# EAGLE design sensors-v2 (EAGLE 9.6.2)
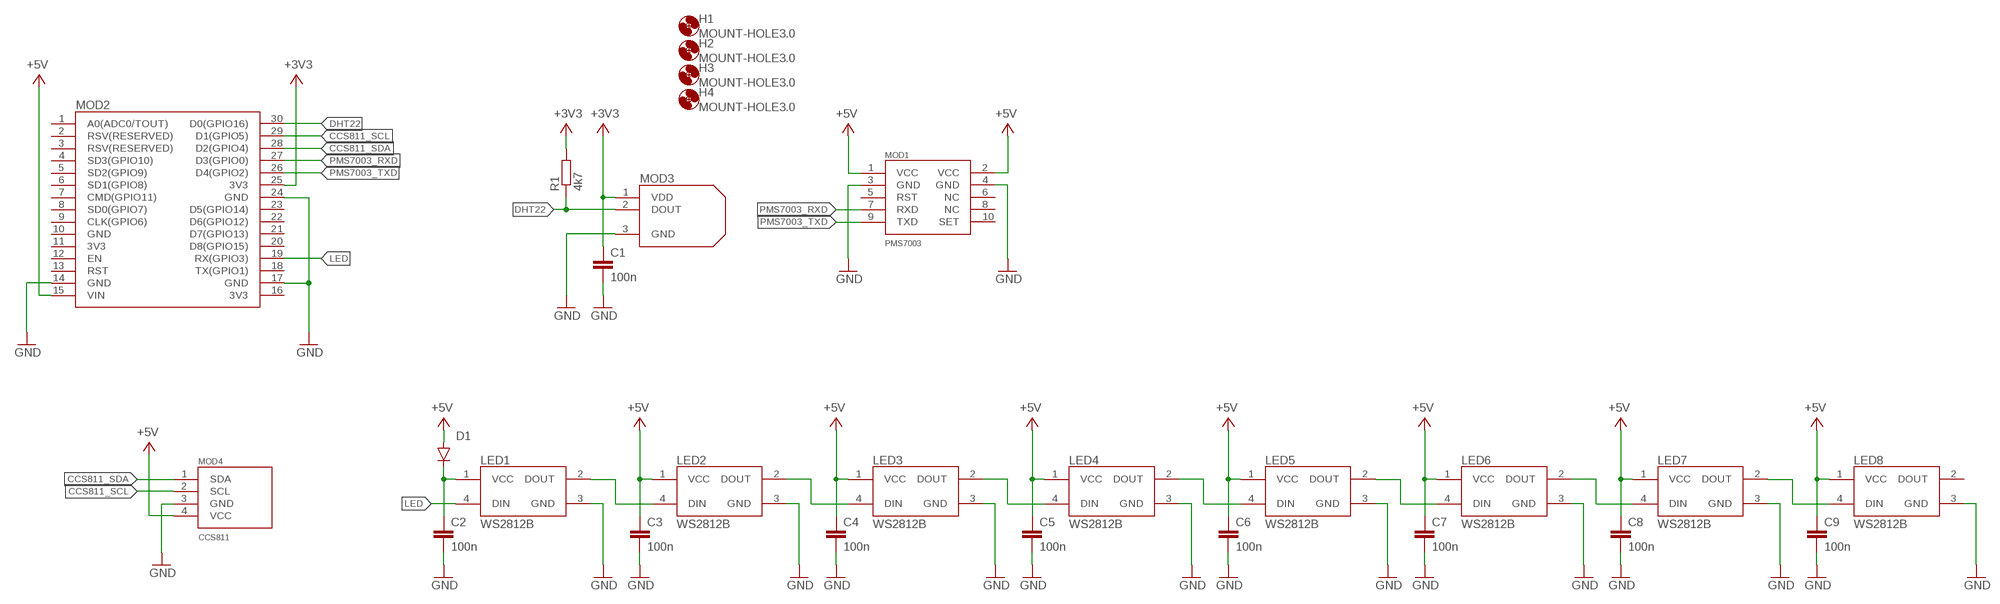
[diagram p0: schematic, sheet 1]

## Parts
C1  100n  C-EUC0603  [C0603]
C2  100n  C-EUC0603  [C0603]
C3  100n  C-EUC0603  [C0603]
C4  100n  C-EUC0603  [C0603]
C5  100n  C-EUC0603  [C0603]
C6  100n  C-EUC0603  [C0603]
C7  100n  C-EUC0603  [C0603]
C8  100n  C-EUC0603  [C0603]
C9  100n  C-EUC0603  [C0603]
D1  DIODE-MINIMELF  [MINIMELF]
H1  MOUNT-HOLE3.0  [3,0]
H2  MOUNT-HOLE3.0  [3,0]
H3  MOUNT-HOLE3.0  [3,0]
H4  MOUNT-HOLE3.0  [3,0]
LED1  WS2812B  [WS2812B]
LED2  WS2812B  [WS2812B]
LED3  WS2812B  [WS2812B]
LED4  WS2812B  [WS2812B]
LED5  WS2812B  [WS2812B]
LED6  WS2812B  [WS2812B]
LED7  WS2812B  [WS2812B]
LED8  WS2812B  [WS2812B]
MOD1  PMS7003  [PMS7003]
MOD2  NODEMCU  NODEMCUWITHOUT-HOLES  [NODEMCU-WITHOUT-HOLES]
MOD3  DHT22  DHT22-3PIN  [DHT22_STRAIGHT-3PIN]
MOD4  CCS811  CCS811_ANGLE  [HDRRAR4W64P254_1X4_1016X736X254B]
R1  4k7  R-EU_M0805  [M0805]

## Nets
+3V3: C1.1 MOD2.25(3V3) MOD3.1(VDD) R1.2
+5V: C3.1 C4.1 C5.1 C6.1 C7.1 C8.1 C9.1 D1.A LED2.1(VCC) LED3.1(VCC) LED4.1(VCC) LED5.1(VCC) LED6.1(VCC) LED7.1(VCC) LED8.1(VCC) MOD1.1(VCC) MOD1.2(VCC) MOD2.15(VIN) MOD4.4(VCC)
CCS811_SCL: MOD2.29(D1(GPIO5)) MOD4.2(SCL)
CCS811_SDA: MOD2.28(D2(GPIO4)) MOD4.1(SDA)
DHT22: MOD2.30(D0(GPIO16)) MOD3.2(DOUT) R1.1
GND: C1.2 C2.2 C3.2 C4.2 C5.2 C6.2 C7.2 C8.2 C9.2 LED1.3(GND) LED2.3(GND) LED3.3(GND) LED4.3(GND) LED5.3(GND) LED6.3(GND) LED7.3(GND) LED8.3(GND) MOD1.3(GND) MOD1.4(GND) MOD2.14(GND) MOD2.17(GND) MOD2.24(GND) MOD3.3(GND) MOD4.3(GND)
LED: LED1.4(DIN) MOD2.19(RX(GPIO3))
N$1: C2.1 D1.C LED1.1(VCC)
N$2: LED2.2(DOUT) LED3.4(DIN)
N$3: LED3.2(DOUT) LED4.4(DIN)
N$4: LED1.2(DOUT) LED2.4(DIN)
N$5: LED4.2(DOUT) LED5.4(DIN)
N$6: LED5.2(DOUT) LED6.4(DIN)
N$7: LED6.2(DOUT) LED7.4(DIN)
N$8: LED7.2(DOUT) LED8.4(DIN)
PMS7003_RXD: MOD1.7(RXD) MOD2.27(D3(GPIO0))
PMS7003_TXD: MOD1.9(TXD) MOD2.26(D4(GPIO2))
Unconnected: LED8.2(DOUT) MOD1.5(RST) MOD1.6(NC) MOD1.8(NC) MOD1.10(SET) MOD2.1(A0(ADC0/TOUT)) MOD2.2(RSV(RESERVED)) MOD2.3(RSV(RESERVED)) MOD2.4(SD3(GPIO10)) MOD2.5(SD2(GPIO9)) MOD2.6(SD1(GPIO8)) MOD2.7(CMD(GPIO11)) MOD2.8(SD0(GPIO7)) MOD2.9(CLK(GPIO6)) MOD2.10(GND) MOD2.11(3V3) MOD2.12(EN) MOD2.13(RST) MOD2.16(3V3) MOD2.18(TX(GPIO1)) MOD2.20(D8(GPIO15)) MOD2.21(D7(GPIO13)) MOD2.22(D6(GPIO12)) MOD2.23(D5(GPIO14))

## Library data of the parts
C1-C9 = rcl:C-EU: CAPACITOR, European symbol; SPICEPREFIX: C
D1 = diode:DIODE-: DIODE
H1-H4 = _Leon-Connectors:MOUNT-HOLE: MOUNTING HOLE with drill center marker
LED1-LED8 = _Leon-IC:WS2812B; PACKAGE: 5050
MOD1 = _Leon-Modules:PMS7003
MOD2 = _Leon-Modules:NODEMCU
MOD3 = _Leon-Modules:DHT22-3PIN
MOD4 = _Leon-Modules:CCS811_ANGLE
R1 = rcl:R-EU_: RESISTOR, European symbol; SPICEPREFIX: R

## Board
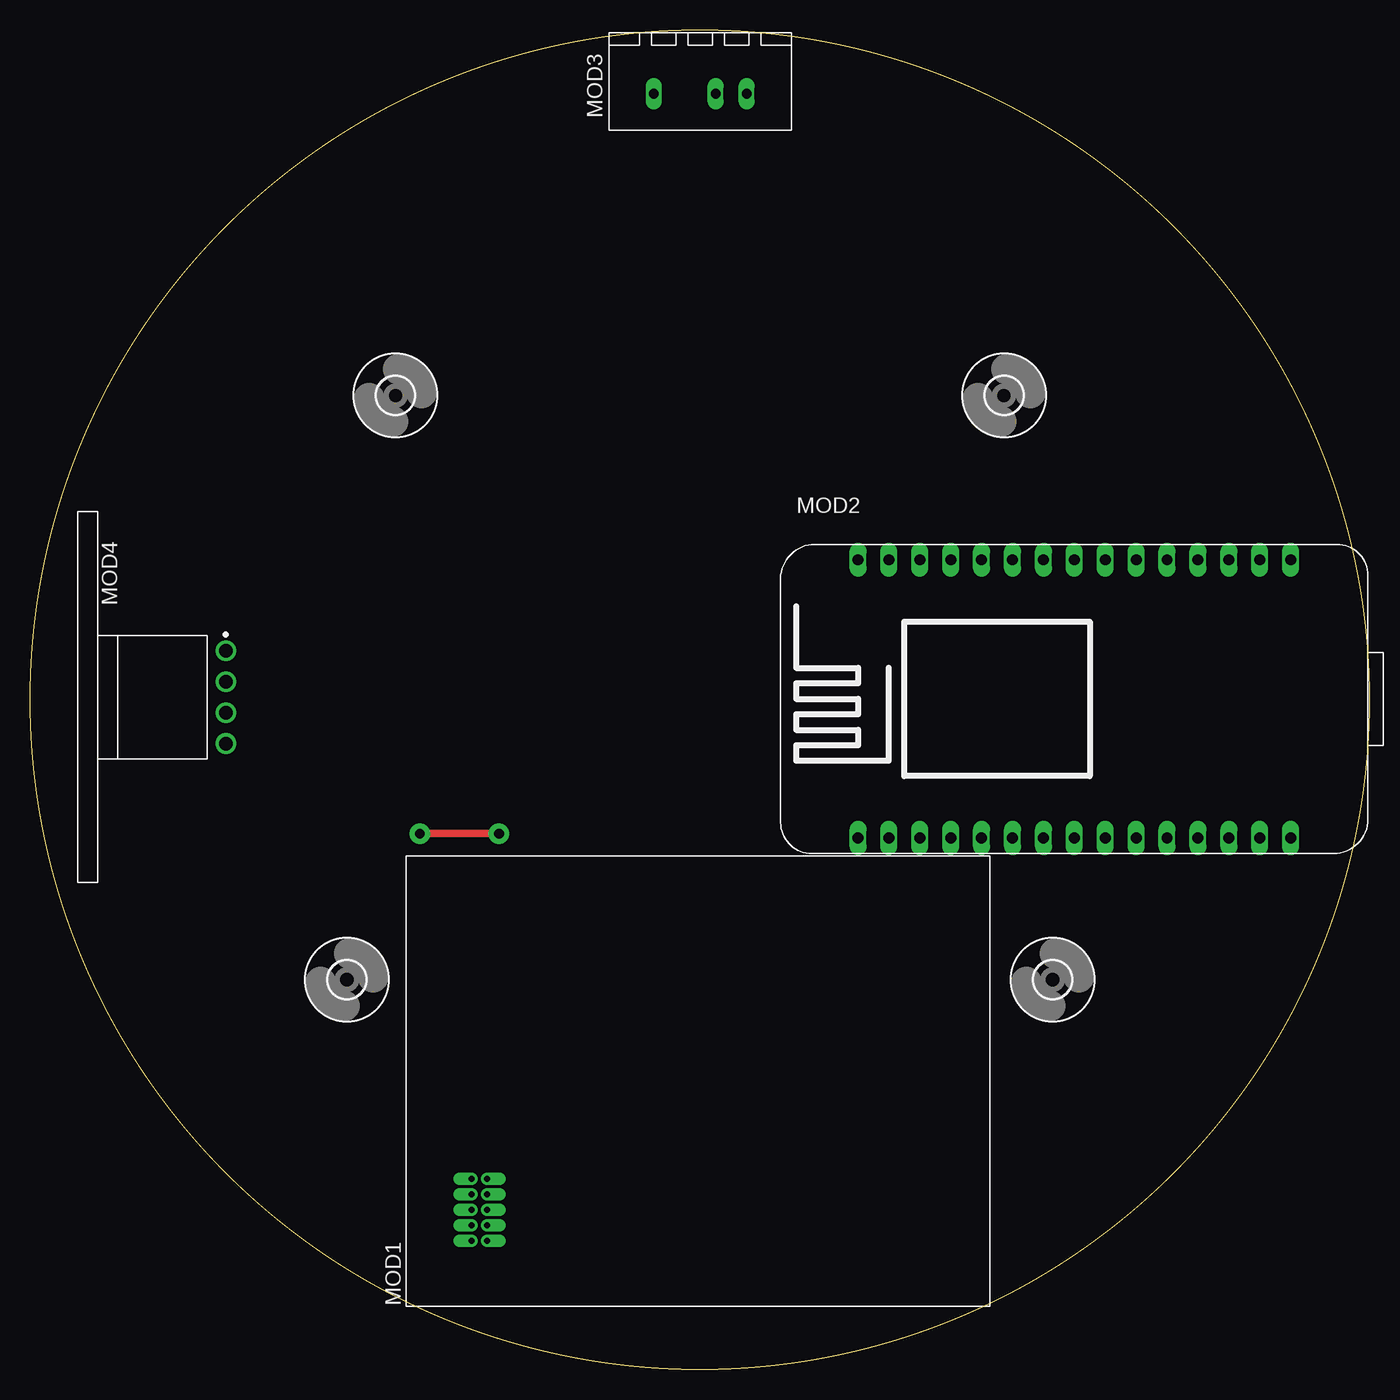
[diagram p1: board, top side]
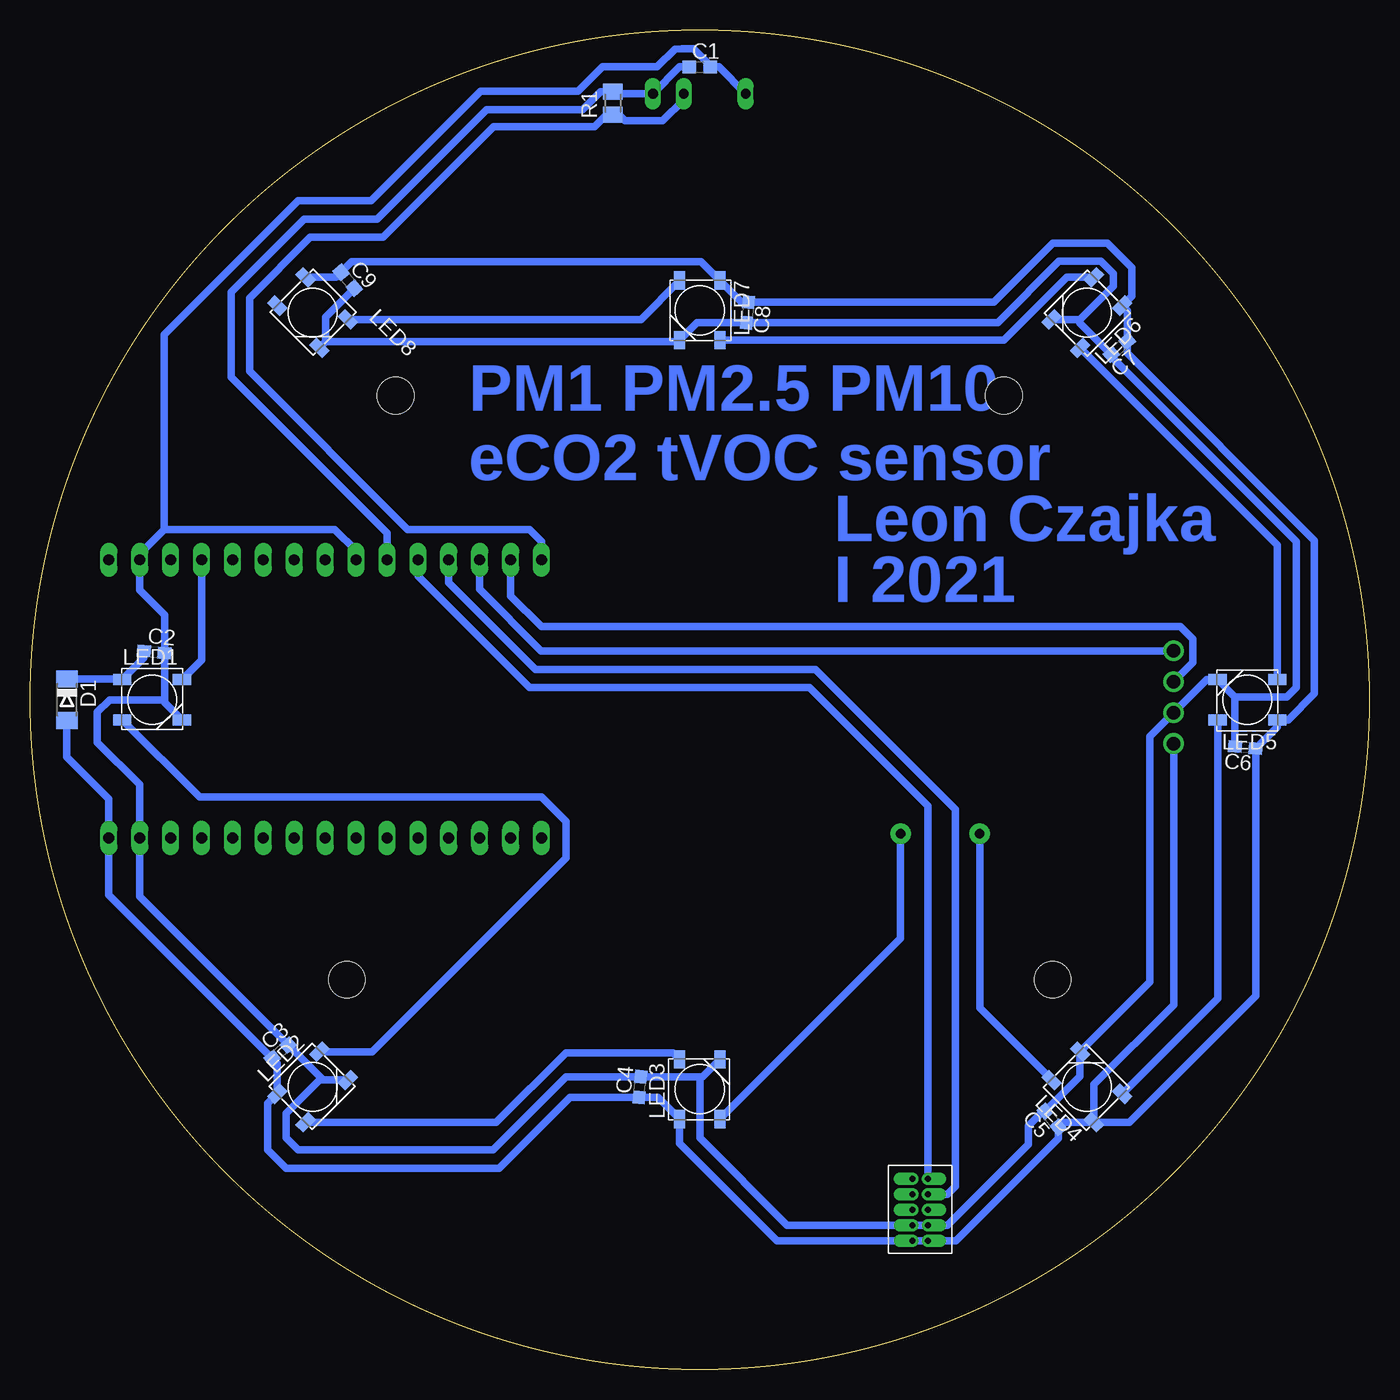
[diagram p2: board, bottom side, seen from below]

Size 110 x 110 mm. Coordinates in mm from the lower left corner, seen from the top.
Outline: circle at 55,55 radius 55
Copper layers (1*16): Top 0.035mm / dielectric 1.5mm / Bottom 0.035mm
Design rules "default": minimum track width 6mil, minimum drill 0.35mm, track to track 6mil, track to pad 6mil, pad to pad 6mil, via to via 6mil, smd to smd 6mil, copper to edge 40mil, drill to drill 6mil, minimum pad ring 10mil, minimum via ring 8mil, stop-mask expansion 4mil, vias tented up to drill 0mil, thermal gap 10mil

### Footprints (pad centres in the part's own frame; a part is rotated, then mirrored left to right if it is on the bottom)
C0603 = smd 1.1 x 1: 1 -0.85,0; 2 0.85,0
MINIMELF = smd 1.4 x 1.8: A 1.7,0; C -1.7,0
3,0 = hole 3: 0,0
WS2812B = smd 1.5 x 0.9: 1 -2.45,1.65; 2 -2.45,-1.65; 3 2.45,-1.65; 4 2.45,1.65
PMS7003 = drill 0.5 offset: 1 5.357,42.473; 2 5.357,41.203; 3 6.627,42.473; 4 6.627,41.203; 5 7.897,42.473; 6 7.897,41.203; 7 9.167,42.473; 8 9.167,41.203; 9 10.437,42.473; 10 10.437,41.203
NODEMCU-WITHOUT-HOLES = drill 0.9 long: 1 0,-22.86; 2 2.54,-22.86; 3 5.08,-22.86; 4 7.62,-22.86; 5 10.16,-22.86; 6 12.7,-22.86; 7 15.24,-22.86; 8 17.78,-22.86; 9 20.32,-22.86; 10 22.86,-22.86; 11 25.4,-22.86; 12 27.94,-22.86; 13 30.48,-22.86; 14 33.02,-22.86; 15 35.56,-22.86; 16 35.56,0; 17 33.02,0; 18 30.48,0; 19 27.94,0; 20 25.4,0; 21 22.86,0; 22 20.32,0; 23 17.78,0; 24 15.24,0; 25 12.7,0; 26 10.16,0; 27 7.62,0; 28 5.08,0; 29 2.54,0; 30 0,0
DHT22_STRAIGHT-3PIN = drill 0.8 long: 1 0,-3.81; 2 0,-1.27; 3 0,3.81
HDRRAR4W64P254_1X4_1016X736X254B = drill 1.105 pad 1.705: 1 -3.81,0; 2 -1.27,0; 3 1.27,0; 4 3.81,0
M0805 = smd 1.3 x 1.6: 1 -0.95,0; 2 0.95,0

### Placement (x,y rotation side)
C1  55,107 0 bottom
C2  99.83,58.92 355 bottom
C3  89.47,26.07 40 bottom
C4  59.92,23.17 85 bottom
C5  26.07,20.53 130 bottom
C6  10.17,51.08 175 bottom
C7  20.53,83.93 220 bottom
C8  51.08,86.83 265 bottom
C9  83.93,89.47 310 bottom
D1  107,55 270 bottom
H1  26,32 0 top
H2  30,80 0 top
H3  80,80 0 top
H4  84,32 0 top
LED1  100,55 0 bottom
LED2  86.82,23.18 45 bottom
LED3  55,23 90 bottom
LED4  23.18,23.18 135 bottom
LED5  10,55 180 bottom
LED6  23.18,86.82 225 bottom
LED7  55,87 270 bottom
LED8  86.82,86.82 315 bottom
MOD1  78.73,5.2 90 top
MOD2  68,66.5 0 top
MOD3  55.04,104.8 90 top
MOD4  16.06,55.21 270 top
R1  62.14,104.02 90 bottom

### Tracks (layer width: path | path; a pad name or v marks a point on that pad's centre or on a via)
+3V3
  Bottom 0.61: C1.1 56.65,107 MOD3.1 61.97,104.8 R1.2 63.14,104.97 64.64,103.47 72.53,103.47 81.5,94.5 87.5,94.5 93.5,88.5 93.5,81.5 80.7,68.7 MOD2.25
+5V
  Bottom 0.61: LED4.1 25.12,20.28 C5.1 25.53,18.97 33.94,10.56 MOD1.1 MOD1.2 48.66,10.56 56.65,18.55 LED3.1 58.42,22.32 C4.1 65.68,22.32 71.5,16.5 89,16.5 90.5,18 90.5,21.83 LED2.1 89.72,25.12 C3.1 103.56,38.97 MOD2.15 103.56,46.86 107,50.3 D1.A | LED4.1 22.62,23.39 16.06,29.94 MOD4.4 | LED4.1 19.72,20.28 9.32,30.68 C6.1 7.55,52.78 LED5.1 6.65,53.35 4.5,55.5 4.5,68.09 19.88,83.47 C7.1 19.88,86.98 LED6.1 19.5,88.17 19.5,90.5 21.5,92.5 26,92.5 30.82,87.68 C8.1 51.58,87.68 LED7.1 54.9,91 83.59,91 C9.1 84.88,89.72 LED8.1
CCS811_SCL
  Bottom 0.61: MOD4.2 14.5,58.04 14.5,60 15.5,61 68,61 70.54,63.54 MOD2.29
CCS811_SDA
  Bottom 0.61: MOD2.28 73.08,64.08 68.02,59.02 MOD4.1
DHT22
  Bottom 0.61: MOD3.2 56.31,104.3 58.04,102.57 61.14,102.57 61.64,103.07 R1.1 62.64,103.07 63.64,102.07 71.93,102.07 81,93 87,93 92,88 92,82 79,69 69,69 68,68 MOD2.30
GND
  Bottom 0.61: LED2.3 85.95,23.75 | C6.2 11.02,55.22 | 11.02,55.22 LED5.3 13.35,56.65 MOD4.3 18,52 18,31.82 LED4.3 23.75,24.05 C5.2 26.82,21.18 28,20 28,18.49 34.66,11.83 MOD1.3 MOD1.4 47.83,11.83 55,19 55,24.02 | 11.02,55.22 6.78,55.22 6,56 6,68 21.18,83.18 C7.2 23.75,85.95 23.75,86.25 | MOD3.3 53.43,107 C1.2 54.15,107.15 55.5,108.5 56.47,108.5 57.05,108.45 58.5,107 63,107 65,105 73,105 82,96 88,96 99,85 99,69 | LED8.3 85.75,84.42 | 85.75,84.42 56.78,84.42 LED7.3 55.22,85.98 C8.2 30.52,85.98 25.48,91.03 22.02,91.03 21,90 21,89 23.75,86.25 | 85.95,23.75 C3.2 101.02,38.82 MOD2.14 101.02,48.02 104.5,51.5 104.5,54 103.5,55 99.2,55 98.98,54.78 | 98.98,54.78 C2.2 98.98,61.98 101.02,64.02 MOD2.17 101.02,66.98 99,69 | 98.98,54.78 LED1.3 | MOD2.24 83.24,67.24 85,69 99,69 | 23.75,86.25 LED6.3 | C9.2 85.75,86.45 85.75,84.42 | 85.95,23.75 86.25,23.75 89,21 89,19 88,18 72,18 65.98,24.02 C4.2 55,24.02 | 55,24.02 54.78,24.02 LED3.3
LED
  Bottom 0.61: LED1.4 95.94,58.26 MOD2.19
N$1
  Bottom 0.61: D1.C 102.5,56.7 LED1.1 100.68,58.42 C2.1
N$2
  Bottom 0.61: LED2.2 71.72,20.28 66,26 57.2,26 LED3.4
N$3  (via drill 0.8 pad 1.7)
  Top 0.61: v32,44 v38.5,44
  Bottom 0.61: LED4.4 32,29.67 v32,44 | LED3.2 38.5,35.4 v38.5,44
N$4
  Bottom 0.61: LED2.4 81.92,26.08 66,42 66,45 68,47 96.1,47 LED1.2
N$5
  Bottom 0.61: LED4.2 12.45,30.45 LED5.4
N$6
  Bottom 0.61: LED5.2 7.55,67.72 LED6.4
N$7
  Bottom 0.61: LED7.4 30,84.55 24.83,89.72 LED6.2
N$8
  Bottom 0.61: LED7.2 59.85,86.25 LED8.4
PMS7003_RXD
  Bottom 0.61: MOD1.7 34.63,14.37 34,15 34,46 45.5,57.5 68.5,57.5 75.62,64.62 MOD2.27
PMS7003_TXD
  Bottom 0.61: MOD2.26 78.16,65.16 69,56 46,56 36.26,46.26 36.26,23.26 36.26,23 MOD1.9

### Text on the board
Bottom: PM1 PM2.5 PM10 / eCO2 tVOC sensor | Leon Czajka | I 2021